# Altium schematic sheet 3_Signals.SCHDOC
size 297 x 209 mm; SheetNumber: 8; SheetTotal: 18; DocumentName: 3_Signals.SCHDOC
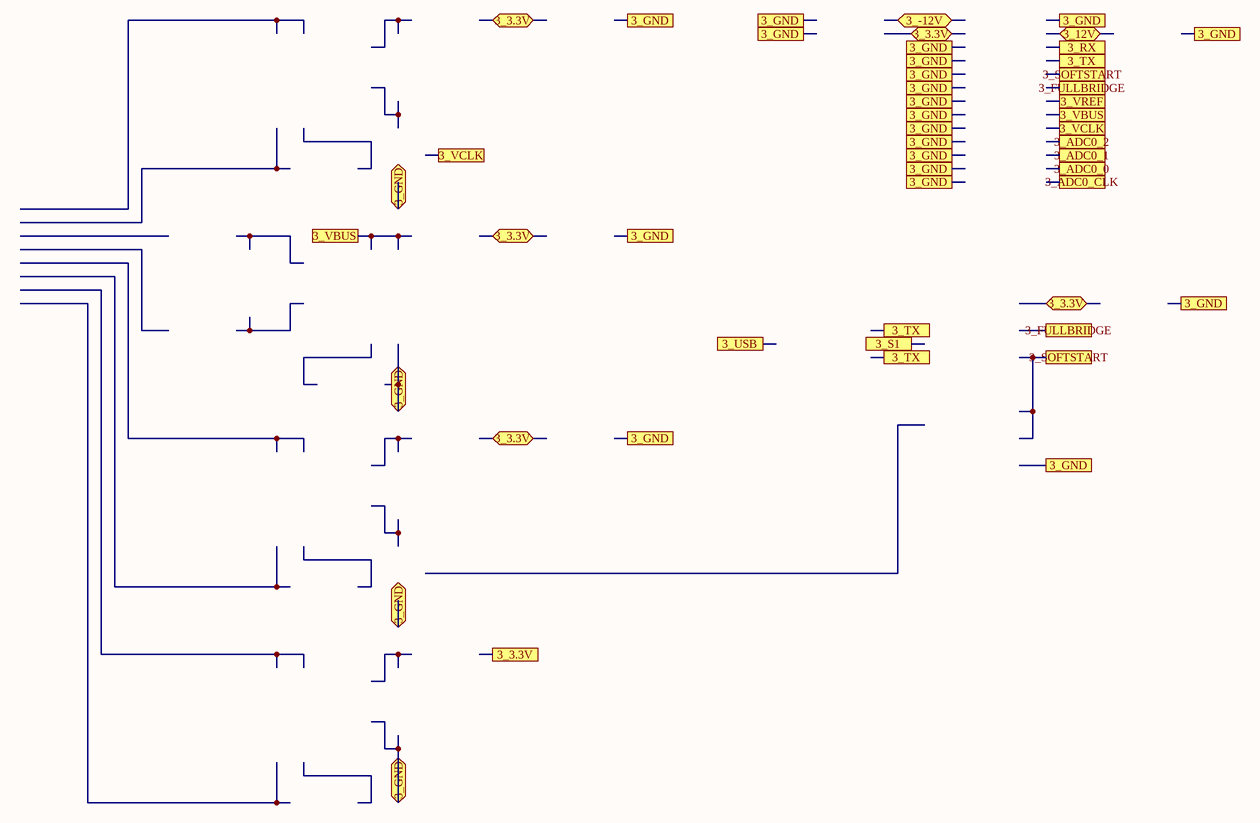
[diagram p0: 3_Signals.SCHDOC]

## Ports
3_3.3V, 3_3.3V (bidir), 3_12V (bidir), 3_-12V (bidir), 3_ADC0_0, 3_ADC0_1, 3_ADC0_2, 3_ADC0_CLK, 3_FULLBRIDGE, 3_GND, 3_RX, 3_S1, 3_SOFTSTART, 3_TX, 3_USB, 3_VBUS, 3_VCLK, 3_VREF

## Notes on the sheet
- A
- B
- C
- D
- 1
- 2
- 3
- Title
- 4
- Size
- A4
- Number
- Rev
- Date
- Filename
- Drawn by
- Sheet
- of